# EAGLE design metaPixel (EAGLE 7.2.0)
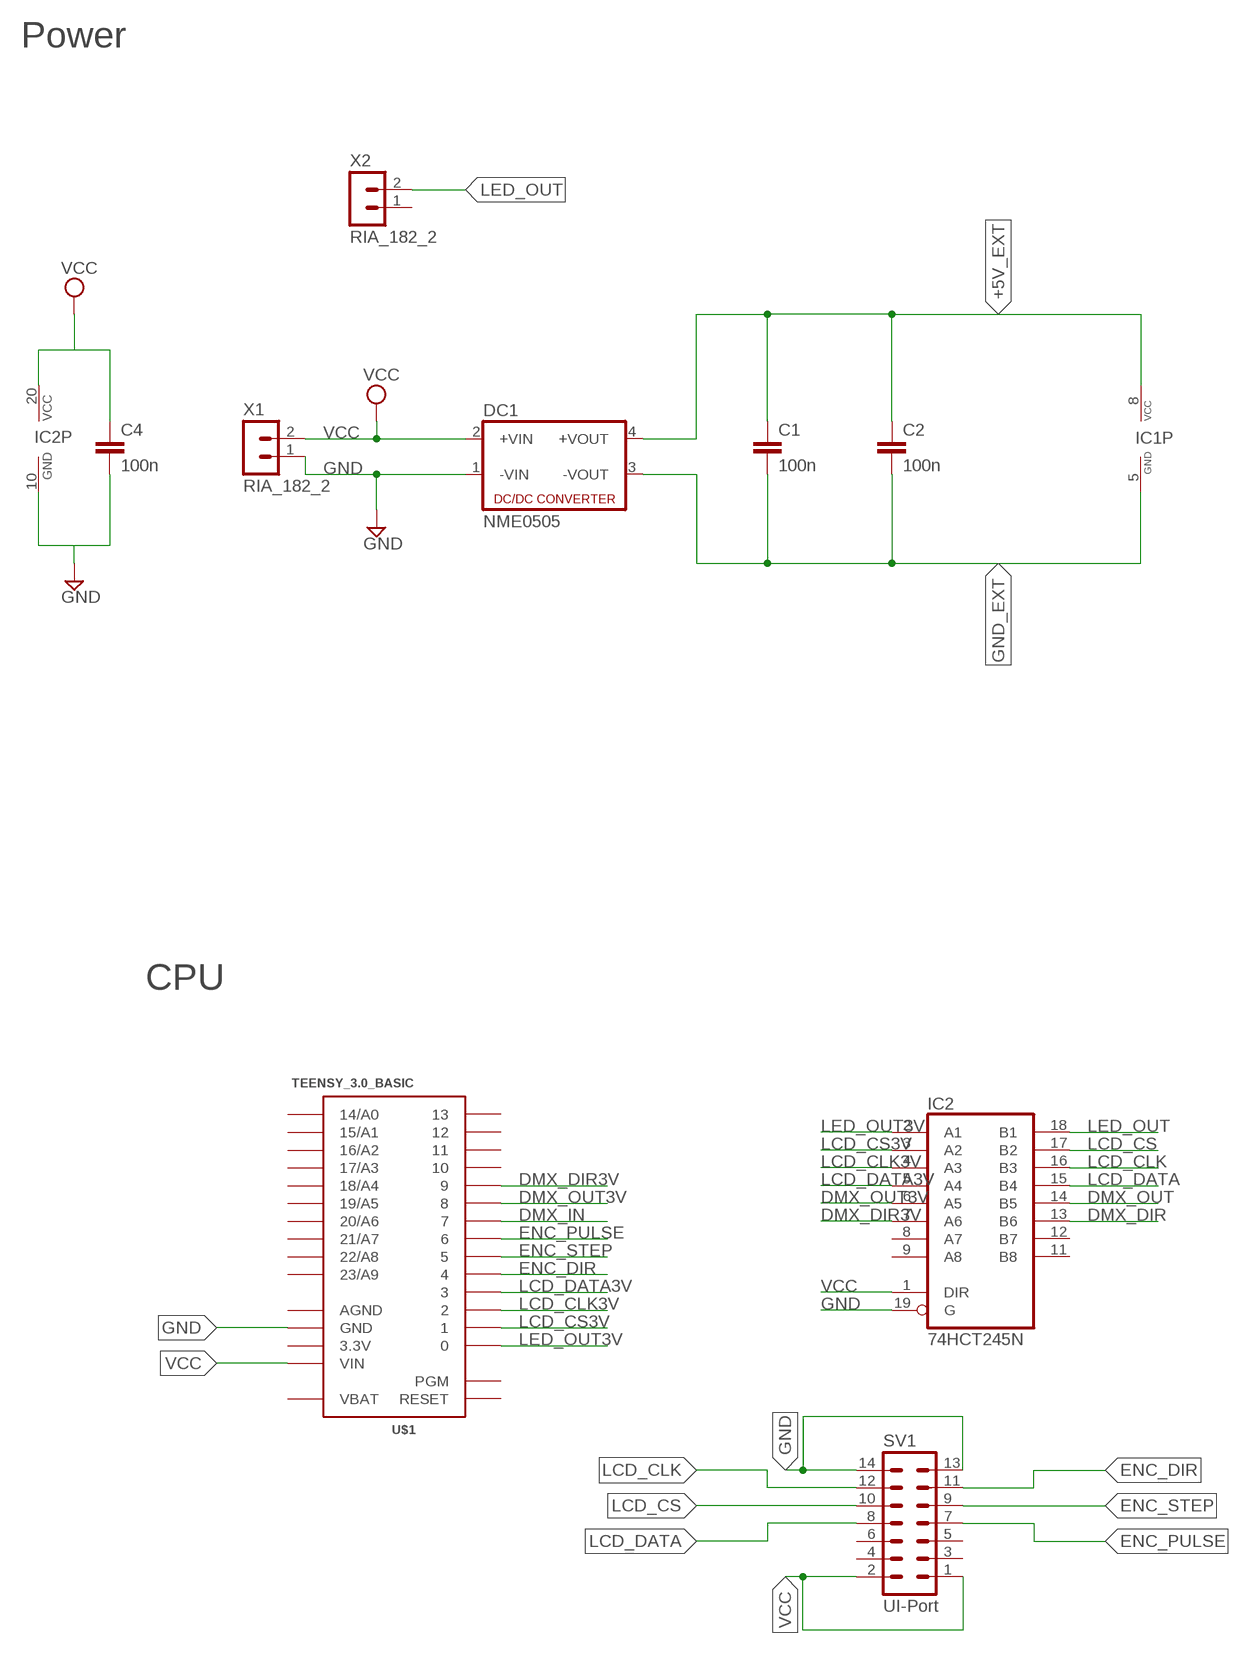
[diagram p0: schematic, sheet 1, part 1 of 2]
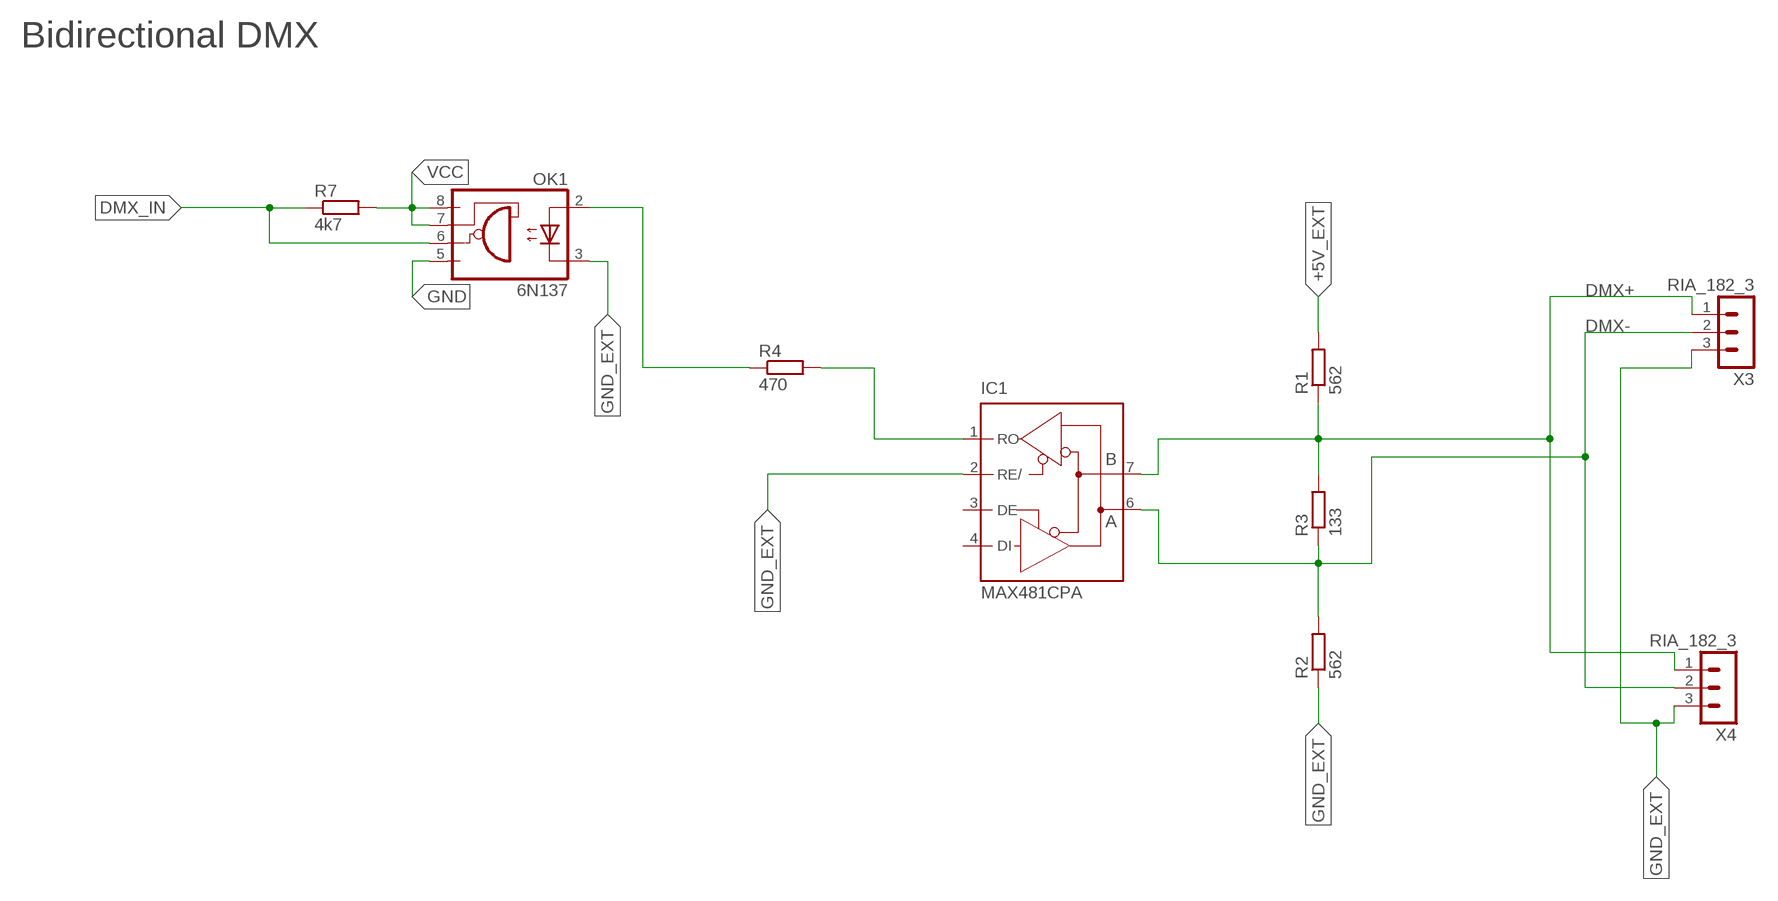
[diagram p1: schematic, sheet 1, part 2 of 2]

## Parts
C1  100n  C-EU025-030X050  [C025-030X050]
C2  100n  C-EU025-030X050  [C025-030X050]
C4  100n  C-EU025-030X050  [C025-030X050]
DC1  NME0505  NME  [NME]
IC1  MAX481CPA  [DIL08]
IC2  74HCT245N  [DIL20]
OK1  6N137  [DIL08]
R1  562  R-EU_0207/7  [0207/7]
R2  562  R-EU_0207/7  [0207/7]
R3  133  R-EU_0207/7  [0207/7]
R4  470  R-EU_0207/10  [0207/10]
R7  4k7  R-EU_0207/10  [0207/10]
SV1  UI-Port  ML14  [ML14]
U$1  TEENSY_3.0_BASIC  [TEENSY_3.0_BASIC]
X1  RIA_182_2  [RIA_182_2]
X2  RIA_182_2  [RIA_182_2]
X3  RIA_182_3  [RIA_182_3]
X4  RIA_182_3  [RIA_182_3]

## Nets
+5V_EXT [SUPPLY]: C1.1 C2.1 DC1.4(+VOUT) IC1.8(VCC) R1.2
DMX+: IC1.7(B) R1.1 R3.2 X3.1 X4.1
DMX-: IC1.6(A) R2.2 R3.1 X3.2 X4.2
DMX_DIR: IC2.13(B6)
DMX_DIR3V: IC2.7(A6) U$1.9
DMX_IN: OK1.6(VO) R7.1 U$1.7
DMX_OUT: IC2.14(B5)
DMX_OUT3V: IC2.6(A5) U$1.8
ENC_DIR: SV1.11 U$1.4
ENC_PULSE: SV1.7 U$1.6
ENC_STEP: SV1.9 U$1.5
GND [SUPPLY]: C4.2 DC1.1(-VIN) IC2.10(GND) IC2.19(G) OK1.5(GND) SV1.13 SV1.14 U$1.GND U$1.GND1(GND) X1.1
GND_EXT [SUPPLY]: C1.2 C2.2 DC1.3(-VOUT) IC1.2(RE/) IC1.5(GND) OK1.3(C) R2.1 X3.3 X4.3
LCD_CLK: IC2.16(B3) SV1.12
LCD_CLK3V: IC2.4(A3) U$1.2
LCD_CS: IC2.17(B2) SV1.10
LCD_CS3V: IC2.3(A2) U$1.1
LCD_DATA: IC2.15(B4) SV1.8
LCD_DATA3V: IC2.5(A4) U$1.3
LED_OUT: IC2.18(B1) X2.2
LED_OUT3V: IC2.2(A1) U$1.0
N$1: OK1.2(A) R4.1
N$2: IC1.1(RO) R4.2
VCC [SUPPLY]: C4.1 DC1.2(+VIN) IC2.1(DIR) IC2.20(VCC) OK1.7(VE) OK1.8(VCC) R7.2 SV1.1 SV1.2 U$1.VIN X1.2
Unconnected: IC1.3(DE) IC1.4(DI) IC2.8(A7) IC2.9(A8) IC2.11(B8) IC2.12(B7) SV1.3 SV1.4 SV1.5 SV1.6 U$1.10 U$1.11 U$1.12 U$1.13 U$1.14/A0 U$1.15/A1 U$1.16/A2 U$1.17/A3 U$1.18/A4 U$1.19/A5 U$1.20/A6 U$1.21/A7 U$1.22/A8 U$1.23/A9 U$1.PGM U$1.RESET X2.1

## Notes on the sheet
- Bidirectional DMX
- Power
- CPU

## Power pins joined to a net without a drawn wire
3.3V: U$1.3.3V U$1.3.3V1(3.3V)
AGND: U$1.AGND
VBAT: U$1.VBAT

## Library data of the parts
C1 C2 C4 = rcl:C-EU: CAPACITOR, European symbol
DC1 = dc-dc-converter:NME: DC-DC CONVERTER; MF: C & D TECHNOLOGIES, INC; MPN: NME1205D; OC_FARNELL: 1021466; OC_NEWARK: 98B8198
IC1 = maxim:MAX481CPA: RS485 TRANSEIVER; MPN: MAX481CPA+; OC_FARNELL: unknown; OC_NEWARK: 99K3445
IC2 = 74xx-eu:74*245: Octal BUS TRANSCEIVER, 3-state
OK1 = optocoupler:6N137: MOTOROLA OPTO COUPLER; MPN: 6N137; OC_FARNELL: 1328376; OC_NEWARK: 52M1895
R1-R3 R7 = resistor:R-EU_: RESISTOR, European symbol
R4 = rcl:R-EU_: RESISTOR, European symbol
SV1 = con-harting-ml:ML14: HARTING; OC_FARNELL: unknown; OC_NEWARK: unknown
U$1 = Teensy3.0:TEENSY_3.0_BASIC: Basic Teensy 3.0 with none of the 'inner' pins enabled. See '+4', 'AllAnalogPins", and 'AllPins' packages for additional pin holes, as needed.
X1 X2 = BlaBlub_USER:RIA_182_2
X3 X4 = BlaBlub_USER:RIA_182_3

## Net classes
0 default: width 0.2 mm
1 SUPPLY: width 0.6 mm

## Board
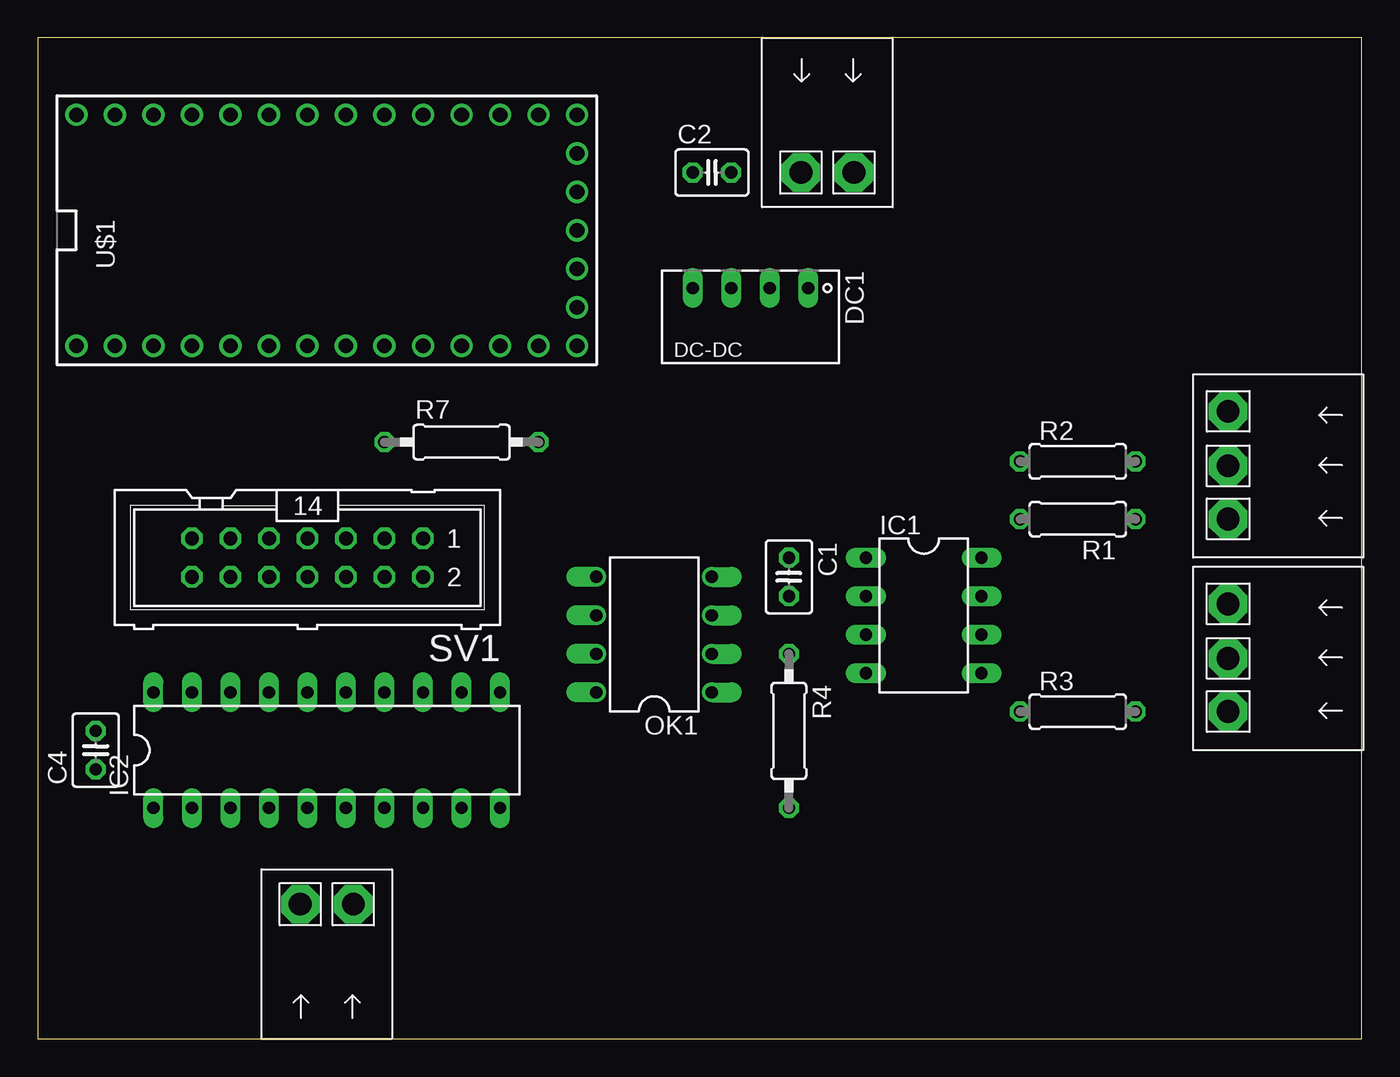
[diagram p2: board, top side]
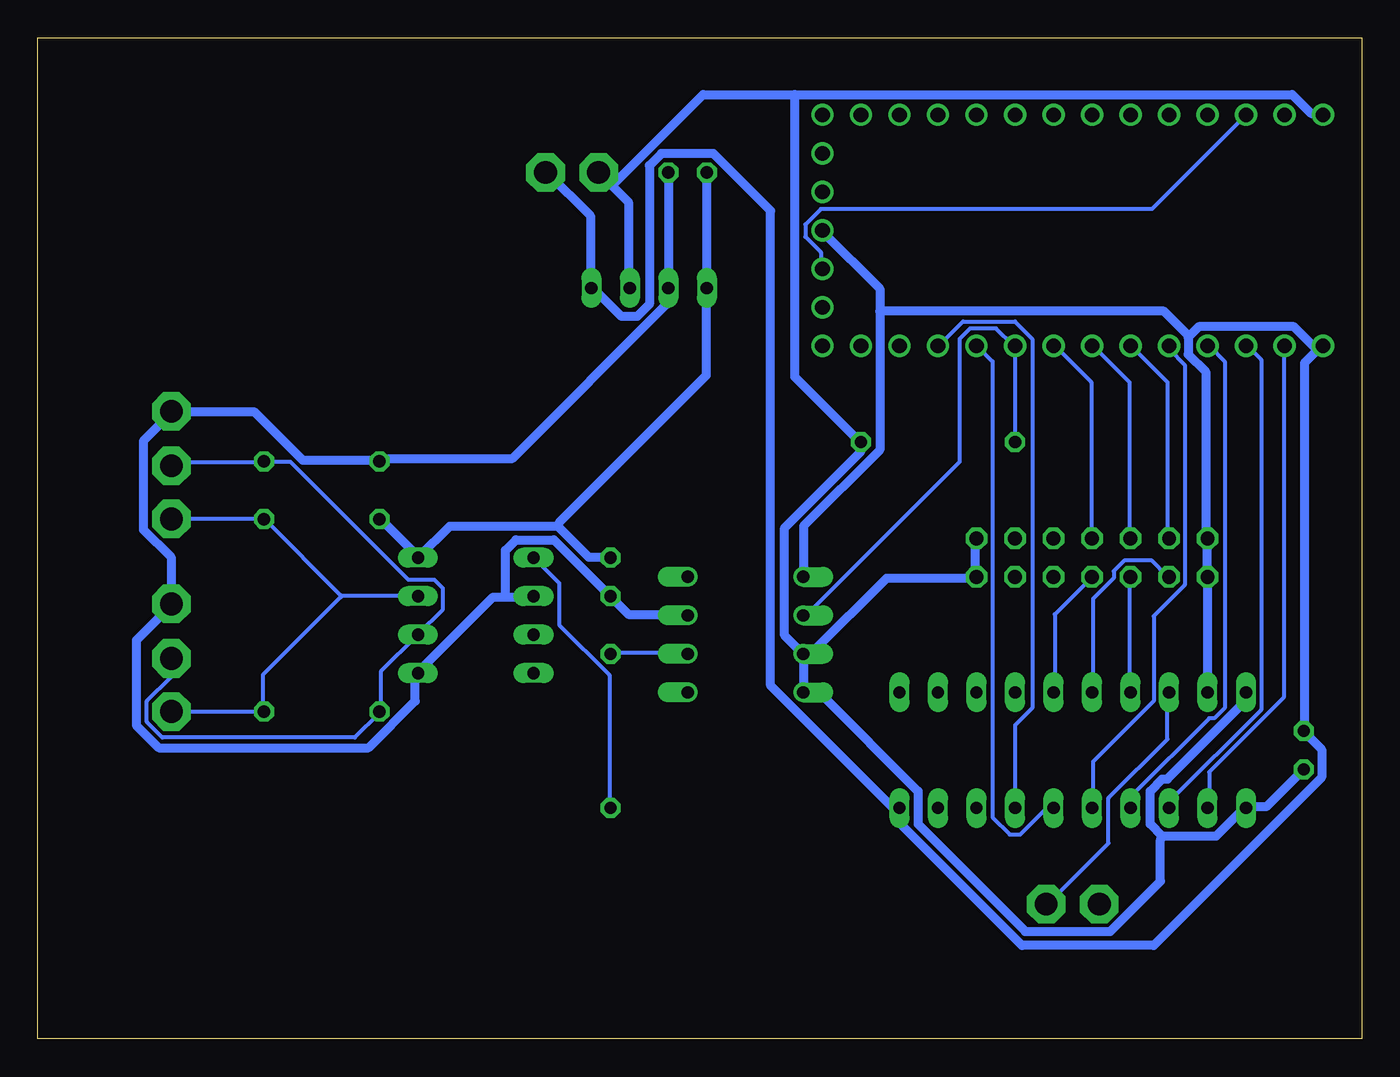
[diagram p3: board, bottom side, seen from below]

Size 87.3 x 66.03 mm. Coordinates in mm from the lower left corner, seen from the top.
Outline: 0,0 87.3,0 87.3,66.03 0,66.03 0,0
Copper layers (1*16): Top 0.035mm / dielectric 1.5mm / Bottom 0.035mm
Design rules "default": minimum track width 10mil, minimum drill 24mil, track to track 8mil, track to pad 8mil, pad to pad 8mil, via to via 8mil, smd to smd 8mil, copper to edge 40mil, drill to drill 8mil, minimum pad ring 10mil, minimum via ring 8mil, stop-mask expansion 4mil, vias tented up to drill 0mil, thermal gap 10mil

### Footprints (pad centres in the part's own frame; a part is rotated, then mirrored left to right if it is on the bottom)
C025-030X050 = drill 0.813 octagon: 1 -1.27,0; 2 1.27,0
NME = drill 0.813 long: 1 0,3.81; 2 0,1.27; 3 0,-1.27; 4 0,-3.81
DIL08 = drill 0.813 long: 1 -3.81,-3.81; 2 -1.27,-3.81; 3 1.27,-3.81; 4 3.81,-3.81; 5 3.81,3.81; 6 1.27,3.81; 7 -1.27,3.81; 8 -3.81,3.81
DIL20 = drill 0.813 long: 1 -11.43,-3.81; 2 -8.89,-3.81; 3 -6.35,-3.81; 4 -3.81,-3.81; 5 -1.27,-3.81; 6 1.27,-3.81; 7 3.81,-3.81; 8 6.35,-3.81; 9 8.89,-3.81; 10 11.43,-3.81; 11 11.43,3.81; 12 8.89,3.81; 13 6.35,3.81; 14 3.81,3.81; 15 1.27,3.81; 16 -1.27,3.81; 17 -3.81,3.81; 18 -6.35,3.81; 19 -8.89,3.81; 20 -11.43,3.81
DIL08' = drill 0.813 offset: 1 -3.81,-3.81; 2 -1.27,-3.81; 3 1.27,-3.81; 4 3.81,-3.81; 5 3.81,3.81; 6 1.27,3.81; 7 -1.27,3.81; 8 -3.81,3.81
0207/7 = drill 0.813 octagon: 1 -3.81,0; 2 3.81,0
0207/10 = drill 0.813 octagon: 1 -5.08,0; 2 5.08,0
ML14 = drill 0.914 octagon: 1 -7.62,-1.27; 2 -7.62,1.27; 3 -5.08,-1.27; 4 -5.08,1.27; 5 -2.54,-1.27; 6 -2.54,1.27; 7 0,-1.27; 8 0,1.27; 9 2.54,-1.27; 10 2.54,1.27; 11 5.08,-1.27; 12 5.08,1.27; 13 7.62,-1.27; 14 7.62,1.27
TEENSY_3.0_BASIC = drill 0.965: 0 -7.62,13.97; 1 -7.62,11.43; 2 -7.62,8.89; 3 -7.62,6.35; 3.3V 7.62,11.43; 3.3V1 -2.54,-16.51; 4 -7.62,3.81; 5 -7.62,1.27; 6 -7.62,-1.27; 7 -7.62,-3.81; 8 -7.62,-6.35; 9 -7.62,-8.89; 10 -7.62,-11.43; 11 -7.62,-13.97; 12 -7.62,-16.51; 13 7.62,-16.51; 14/A0 7.62,-13.97; 15/A1 7.62,-11.43; 16/A2 7.62,-8.89; 17/A3 7.62,-6.35; 18/A4 7.62,-3.81; 19/A5 7.62,-1.27; 20/A6 7.62,1.27; 21/A7 7.62,3.81; 22/A8 7.62,6.35; 23/A9 7.62,8.89; AGND 7.62,13.97; GND -7.62,16.51; GND1 0,-16.51; PGM 2.54,-16.51; RESET 5.08,-16.51; VBAT -5.08,-16.51; VIN 7.62,16.51
RIA_182_2 = drill 1.5 pad 2.54 octagon: 1 0,-1.75; 2 0,1.75
RIA_182_3 = drill 1.5 pad 2.54 octagon: 1 2.3,2.55; 2 2.3,6.05; 3 2.3,9.65

### Placement (x,y rotation side)
C1  49.53,30.48 270 top
C2  44.45,57.15 0 top
C4  3.81,19.05 90 top
DC1  46.99,49.53 270 top
IC1  58.42,27.94 270 top
IC2  19.05,19.05 0 top
OK1  6N137  [DIL08']  40.64,26.67 90 top
R1  68.58,34.29 180 top
R2  68.58,38.1 0 top
R3  68.58,21.59 0 top
R4  49.53,20.32 270 top
R7  27.94,39.37 0 top
SV1  17.78,31.75 180 top
U$1  19.05,53.34 90 top
X1  52.07,57.15 90 top
X2  19.05,8.89 270 top
X3  76.2,31.75 0 top
X4  76.2,19.05 0 top

### Tracks (layer width: path | path; a pad name or v marks a point on that pad's centre or on a via)
3.3V
  Bottom 0.254: U$1.3.3V 13.83,54.75 35.66,54.75 36.69,53.72 36.69,52.92 35.66,51.89 35.66,50.86 U$1.3.3V1
+5V_EXT
  Bottom 0.6: C2.1 43.2,57.15 43.2,49.61 DC1.4 43.2,49.26 43.2,43.78 52.92,34.06 53.03,33.83 | 53.03,33.83 50.98,31.77 49.61,31.77 C1.1 | 53.03,33.83 60.12,33.83 62.18,31.77 IC1.8 62.29,31.89 64.69,34.29 R1.2
DMX+
  Bottom 0.254: X4.1 78.41,21.6 72.47,21.6 R3.2 72.47,21.72 72.47,24 67.32,29.15 67.32,29.26 | 67.32,29.26 62.29,29.26 IC1.7 | 67.32,29.26 72.35,34.29 R1.1 78.41,34.29 X3.1
DMX-
  Bottom 0.254: X3.2 78.41,37.83 78.18,38.06 72.47,38.06 R2.2 72.35,38.06 70.64,38.06 62.87,30.29 61.15,30.29 60.58,29.72 60.58,28.35 62.18,26.75 IC1.6 62.29,26.63 64.69,24.23 64.69,21.6 R3.1 64.81,21.49 66.41,19.89 79.1,19.89 80.12,20.92 80.12,22.29 78.52,23.89 78.52,25.03 X4.2
DMX_DIR3V
  Bottom 0.254: IC2.7 22.86,20.69 21.72,21.83 21.72,46.18 22.86,47.32 26.29,47.32 27.89,45.72 U$1.9
DMX_IN
  Bottom 0.254: R7.1 U$1.7 22.97,45.72 24.12,46.86 25.83,46.86 26.52,46.18 26.52,38.06 36.58,28 36.8,28 OK1.6
DMX_OUT3V
  Bottom 0.254: IC2.6 20.34,15.2 20.8,15.2 22.52,13.49 23.2,13.49 24.35,14.63 24.35,44.69 25.38,45.72 U$1.8
ENC_DIR
  Bottom 0.254: SV1.11 12.8,33.03 12.8,43.32 15.2,45.72 U$1.4
ENC_PULSE
  Bottom 0.254: SV1.7 17.83,33.03 17.83,43.32 20.23,45.72 U$1.6
ENC_STEP
  Bottom 0.254: SV1.9 15.32,33.03 15.32,43.32 17.72,45.72 U$1.5
GND
  Bottom 0.6: 31.77,48.01 31.77,49.49 35.55,53.26 U$1.GND1 | 31.77,48.01 31.77,38.86 36.8,33.83 36.8,30.52 OK1.5 | X1.1 53.72,57.15 50.86,54.29 50.86,49.61 DC1.1 50.52,49.38 48.81,47.66 47.78,47.66 46.98,48.46 46.98,57.61 46.18,58.41 42.75,58.41 38.98,54.63 38.98,23.32 30.98,15.32 30.75,15.32 IC2.10 30.4,15.2 30.4,14.17 22.4,6.17 13.72,6.17 2.63,17.26 2.63,19.09 3.66,20.12 C4.2 3.77,20.34 3.77,44.58 2.63,45.72 U$1.GND 3.09,45.61 4.46,46.98 10.74,46.98 11.43,46.29 | IC2.19 10.17,22.86 10.17,30.4 SV1.14 10.17,30.75 10.17,32.92 SV1.13 10.29,33.26 10.29,44.01 11.43,45.15 11.43,46.29 | 31.77,48.01 13.03,48.01 11.54,46.52 11.43,46.29
GND_EXT
  Bottom 0.6: OK1.3 44.46,28 48.35,28 49.49,29.15 C1.2 49.72,29.38 53.26,32.92 55.78,32.92 56.46,32.23 56.46,29.15 | 56.46,29.15 57.26,29.15 62.18,24.23 IC1.5 62.41,23.89 62.41,22.29 65.49,19.2 79.32,19.2 80.81,20.69 80.81,26.29 78.64,28.46 X4.3 78.52,28.8 78.52,31.77 80.35,33.6 80.35,39.43 78.64,41.15 X3.3 78.41,41.38 73.04,41.38 69.84,38.18 64.81,38.18 R2.1 64.58,38.29 56.01,38.29 45.83,48.46 45.83,49.26 DC1.3 C2.2 | 56.46,29.15 54.63,29.15 IC1.2
LCD_CLK
  Bottom 0.254: IC2.16 17.72,22.86 17.72,29.03 16.34,30.4 16.34,30.86 15.66,31.55 13.83,31.55 12.8,30.52 SV1.12
LCD_CLK3V
  Bottom 0.254: IC2.4 15.2,15.32 15.2,16 10.06,21.14 9.72,21.14 9.03,21.83 9.03,44.69 10.06,45.72 U$1.2
LCD_CS
  Bottom 0.254: IC2.17 15.32,22.86 15.32,30.4 SV1.10
LCD_CS3V
  Bottom 0.254: IC2.3 12.69,15.32 12.69,15.66 6.63,21.72 6.63,44.81 7.54,45.72 U$1.1
LCD_DATA
  Bottom 0.254: IC2.15 20.23,22.86 20.23,28 17.83,30.4 SV1.8
LCD_DATA3V
  Bottom 0.254: IC2.5 17.72,15.32 17.72,18.29 13.72,22.29 13.72,27.89 11.66,29.95 11.66,44.46 12.69,45.49 12.69,45.72 U$1.3
LED_OUT
  Bottom 0.254: IC2.18 12.8,22.86 12.8,19.77 16.69,15.89 16.69,12.92 20.69,8.91 X2.2
LED_OUT3V
  Bottom 0.254: IC2.2 10.06,15.32 10.06,17.6 5.14,22.52 5.14,45.72 U$1.0
N$1
  Bottom 0.254: OK1.2 44.46,25.49 49.49,25.49 R4.1
N$2
  Bottom 0.254: IC1.1 52.92,30.06 52.92,27.32 49.61,24 49.61,15.32 R4.2
VCC
  Bottom 0.6: DC1.2 48.35,49.61 48.35,55.21 50.29,57.15 X1.2 49.26,56.46 43.43,62.29 37.38,62.29 | 37.38,62.29 4.57,62.29 3.31,61.04 2.63,61.04 U$1.VIN | C4.1 3.89,17.72 6.29,15.32 7.54,15.32 IC2.1 7.89,15.09 9.6,13.37 13.14,13.37 | 13.14,13.37 13.95,14.17 13.95,16.34 13.14,17.14 12.8,17.14 7.66,22.29 7.66,22.86 IC2.20 | SV1.1 25.49,32.92 25.49,30.52 SV1.2 25.72,30.4 31.32,30.4 36.23,25.49 36.58,25.49 OK1.7 | OK1.7 38.06,26.63 38.06,33.72 33.03,38.75 33.03,39.32 R7.2 33.26,39.55 37.38,43.66 37.38,62.29 | OK1.7 36.8,25.15 36.8,22.86 OK1.8 36.58,22.75 35.66,22.75 29.26,16.34 29.26,14.17 22.17,7.09 16.57,7.09 13.26,10.4 13.26,13.14 13.14,13.37